# Altium schematic sheet P4_LEDS.SchDoc
size A
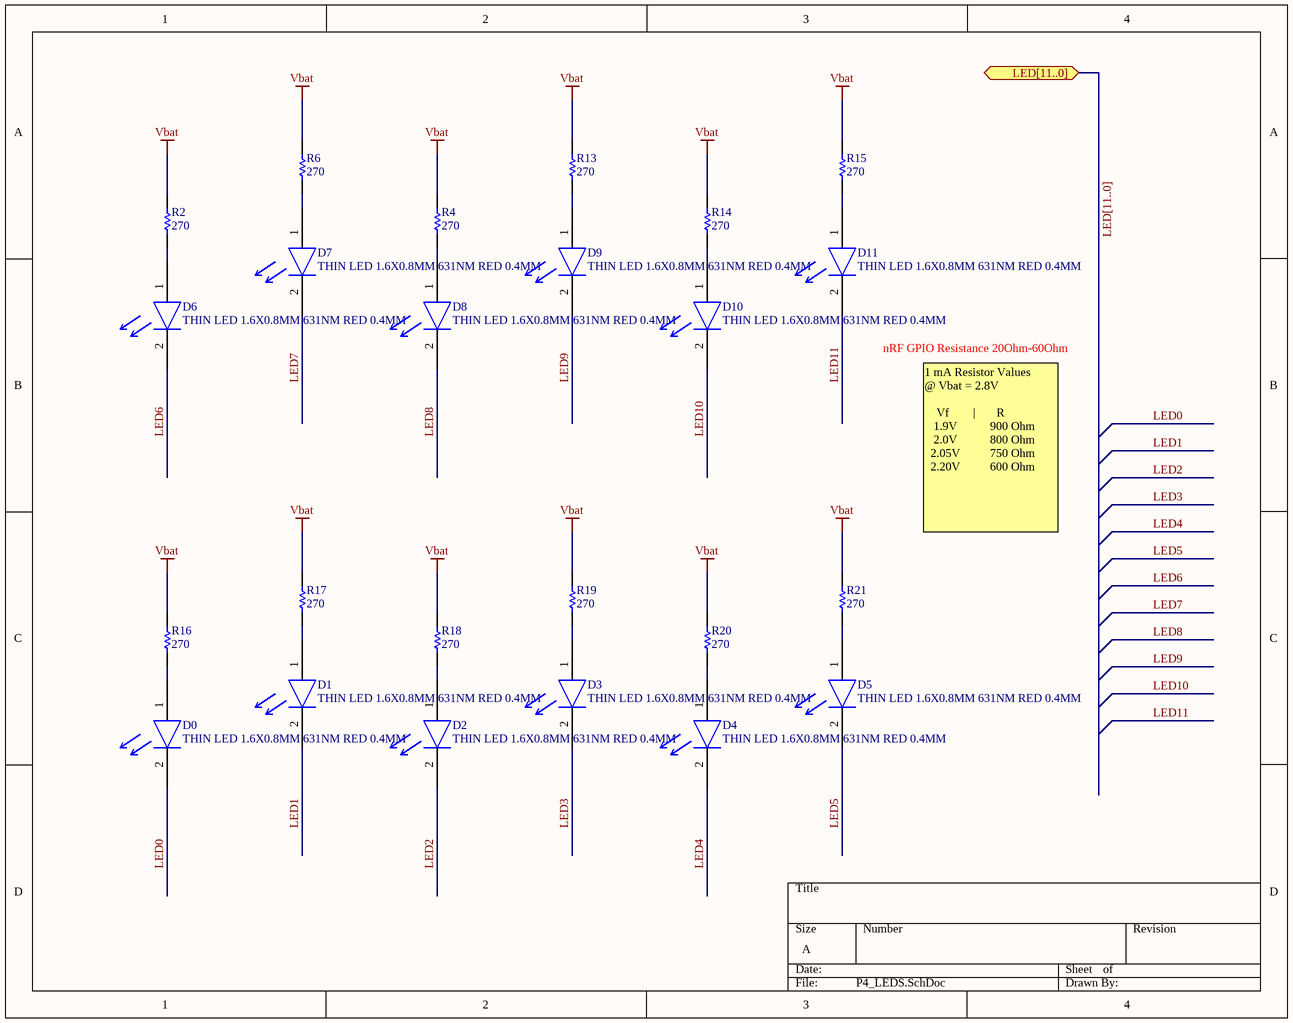
[diagram p0: P4_LEDS.SchDoc]

## Parts
D0  THIN LED 1.6X0.8MM 631NM RED 0.4MM  [LEDC0603(1608)_N]
D1  THIN LED 1.6X0.8MM 631NM RED 0.4MM  [LEDC0603(1608)_N]
D2  THIN LED 1.6X0.8MM 631NM RED 0.4MM  [LEDC0603(1608)_N]
D3  THIN LED 1.6X0.8MM 631NM RED 0.4MM  [LEDC0603(1608)_N]
D4  THIN LED 1.6X0.8MM 631NM RED 0.4MM  [LEDC0603(1608)_N]
D5  THIN LED 1.6X0.8MM 631NM RED 0.4MM  [LEDC0603(1608)_N]
D6  THIN LED 1.6X0.8MM 631NM RED 0.4MM  [LEDC0603(1608)_N]
D7  THIN LED 1.6X0.8MM 631NM RED 0.4MM  [LEDC0603(1608)_N]
D8  THIN LED 1.6X0.8MM 631NM RED 0.4MM  [LEDC0603(1608)_N]
D9  THIN LED 1.6X0.8MM 631NM RED 0.4MM  [LEDC0603(1608)_N]
D10  THIN LED 1.6X0.8MM 631NM RED 0.4MM  [LEDC0603(1608)_N]
D11  THIN LED 1.6X0.8MM 631NM RED 0.4MM  [LEDC0603(1608)_N]
R2  value 270  [RESC0201(0603)_N]  (hidden comment: RES 270 OHM 1/20W 5% 0201 SMD)
R4  value 270  [RESC0201(0603)_N]  (hidden comment: RES 270 OHM 1/20W 5% 0201 SMD)
R6  value 270  [RESC0201(0603)_N]  (hidden comment: RES 270 OHM 1/20W 5% 0201 SMD)
R13  value 270  [RESC0201(0603)_N]  (hidden comment: RES 270 OHM 1/20W 5% 0201 SMD)
R14  value 270  [RESC0201(0603)_N]  (hidden comment: RES 270 OHM 1/20W 5% 0201 SMD)
R15  value 270  [RESC0201(0603)_N]  (hidden comment: RES 270 OHM 1/20W 5% 0201 SMD)
R16  value 270  [RESC0201(0603)_N]  (hidden comment: RES 270 OHM 1/20W 5% 0201 SMD)
R17  value 270  [RESC0201(0603)_N]  (hidden comment: RES 270 OHM 1/20W 5% 0201 SMD)
R18  value 270  [RESC0201(0603)_N]  (hidden comment: RES 270 OHM 1/20W 5% 0201 SMD)
R19  value 270  [RESC0201(0603)_N]  (hidden comment: RES 270 OHM 1/20W 5% 0201 SMD)
R20  value 270  [RESC0201(0603)_N]  (hidden comment: RES 270 OHM 1/20W 5% 0201 SMD)
R21  value 270  [RESC0201(0603)_N]  (hidden comment: RES 270 OHM 1/20W 5% 0201 SMD)

## Ports
LED[11..0]

## Nets
Vbat: R2.1 R4.1 R6.1 R13.1 R14.1 R15.1 R16.1 R17.1 R18.1 R19.1 R20.1 R21.1
LED0: D0.2(Cathode)
LED1: D1.2(Cathode)
LED2: D2.2(Cathode)
LED3: D3.2(Cathode)
LED4: D4.2(Cathode)
LED5: D5.2(Cathode)
LED6: D6.2(Cathode)
LED7: D7.2(Cathode)
LED8: D8.2(Cathode)
LED9: D9.2(Cathode)
LED10: D10.2(Cathode)
LED11: D11.2(Cathode)
NetD0_1: D0.1(anode) R16.2
NetD1_1: D1.1(anode) R17.2
NetD2_1: D2.1(anode) R18.2
NetD3_1: D3.1(anode) R19.2
NetD4_1: D4.1(anode) R20.2
NetD5_1: D5.1(anode) R21.2
NetD6_1: D6.1(anode) R2.2
NetD7_1: D7.1(anode) R6.2
NetD8_1: D8.1(anode) R4.2
NetD9_1: D9.1(anode) R13.2
NetD10_1: D10.1(anode) R14.2
NetD11_1: D11.1(anode) R15.2

## Buses and harness runs
bus LED[11..0] = port LED[11..0]

## Notes on the sheet
- nRF GPIO Resistance 20Ohm-60Ohm
- 1 mA Resistor Values
  @ Vbat = 2.8V
  Vf        |       R
  1.9V           900 Ohm
  2.0V           800 Ohm
  2.05V          750 Ohm
  2.20V          600 Ohm

## Library data of the parts
D0-D11 = 03-07205-000: Light Emitting Diode; Manufacturer 1: Osram; Manufacturer Part Number 1: LR Q396-P1Q2-1; Forward Voltage: 2V; Package / Case: 0603(1608); RoHS: Y; Item Number: 03-07205-000; Lifecycle: Preliminary; Link to Arena Files: https://app.bom.com/a/7P8HNI1I1KK6KAA1?v=files.associations; Supplier 1: Avnet; Supplier Part Number 1: LR Q396-P1Q2-1
R2 R4 R6 R13-R21 = 03-03249-000: Manufacturer 1: Panasonic Electronic Components; Manufacturer Part Number 1: ERJ-1GEJ271C; Case EIA: 201; Case Metric: 603; Tolerance: +/-5%; Legacy Item Number: R02059; Power Rating: 0.05W 1/20W; RoHS: Y; Item Number: 03-03249-000; Lifecycle: Preliminary; Link to Arena Files: https://app.bom.com/a/I0JSYTCTCVVIWRAT?v=files.associations; Supplier 1: Digi-key; Supplier Part Number 1: P270AGCT-ND; Manufacturer 2: Yageo; Manufacturer Part Number 2: RC0201JR-07270RL; Supplier 2: Digi-key; Supplier Part Number 2: 311-270NCT-ND